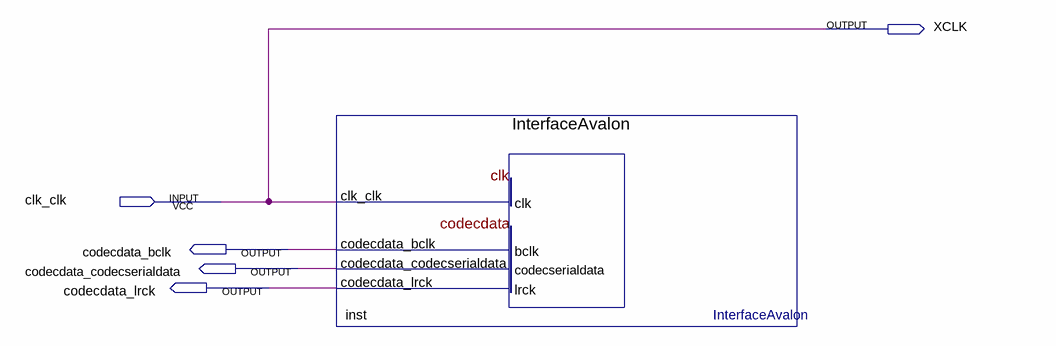
[diagram p0: schematic sheet]
// Quartus schematic niosAudio.bdf as structural Verilog: 1 symbols, 5 pins
module niosAudio (
  input  clk_clk,
  output XCLK,
  output codecdata_bclk,
  output codecdata_codecserialdata,
  output codecdata_lrck
);

  InterfaceAvalon inst (
    .clk_clk(clk_clk), .codecdata_bclk(codecdata_bclk),
    .codecdata_codecserialdata(codecdata_codecserialdata), .codecdata_lrck(codecdata_lrck));

  assign XCLK = clk_clk;
endmodule
